# EAGLE design mini48-v0.3 (EAGLE 5.11)
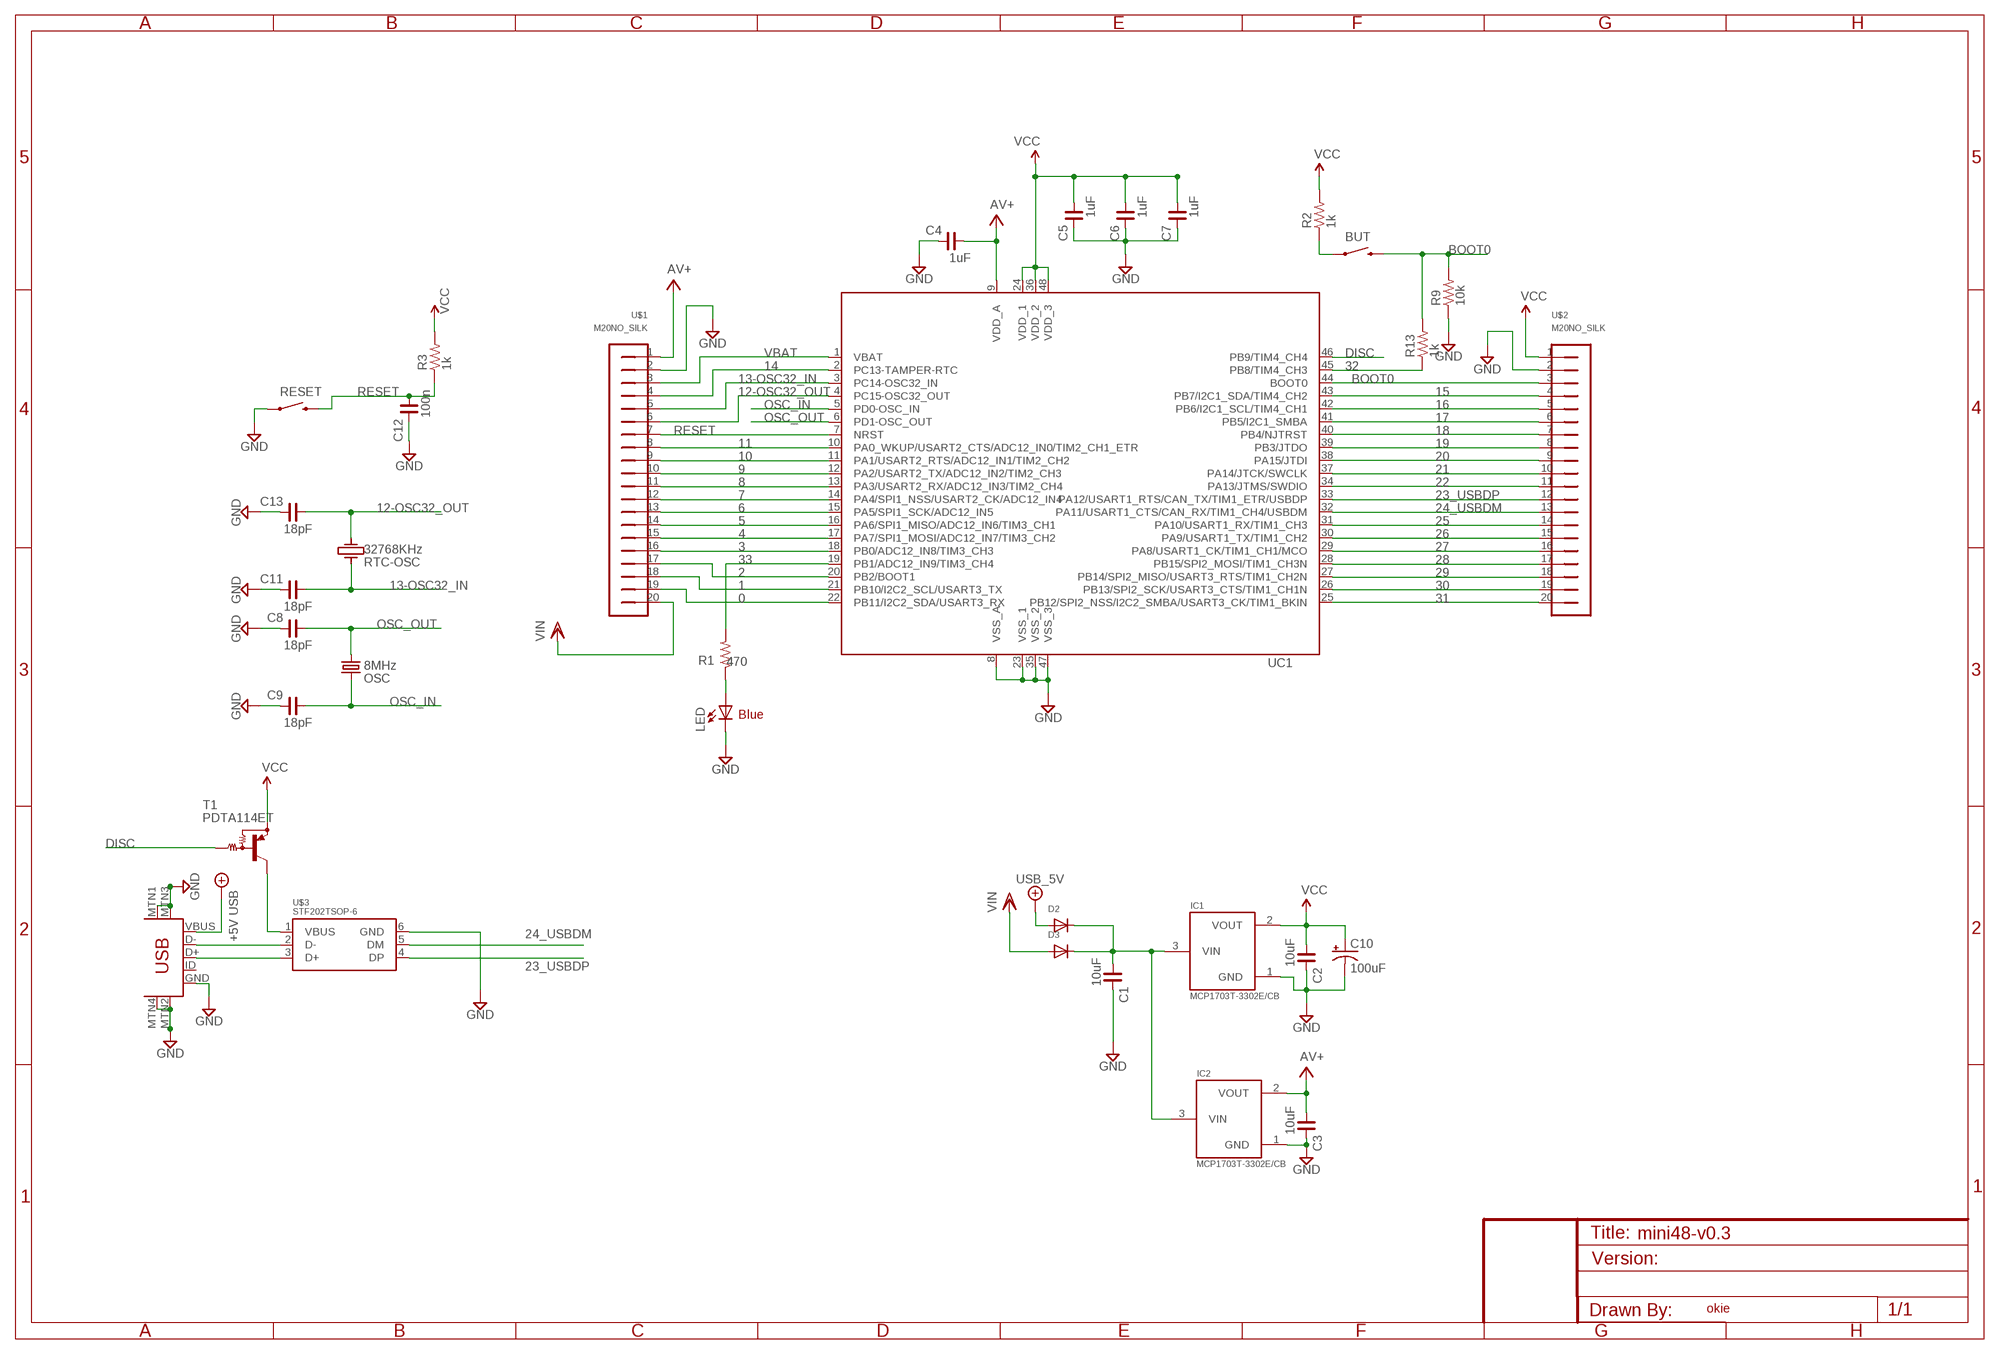
[diagram p0: schematic, sheet 1]

## Parts
BUT  SWITCH-MOMENTARY-2-SMD-1101NE  [TACTILE-SWITCH-1101NE]
C1  10uF  C_0805  [C0805]
C2  10uF  C_0805  [C0805]
C3  10uF  C_0805  [C0805]
C4  1uF  C_0603  [C0603]
C5  1uF  C_0603  [C0603]
C6  1uF  C_0603  [C0603]
C7  1uF  C_0603  [C0603]
C8  18pF  C_0603  [C0603]
C9  18pF  C_0603  [C0603]
C10  100uF  CAP_POL3528  [EIA3528]
C11  18pF  C_0603  [C0603]
C12  100n  C_0603  [C0603]
C13  18pF  C_0603  [C0603]
D2  DIODESOD-323  [SOD-323]
D3  DIODESOD-323  [SOD-323]
IC1  MCP1703T-3302E/CB  MCP1700T  [SOT23]
IC2  MCP1703T-3302E/CB  MCP1700T  [SOT23]
LED  LED (Mini)  LEDCHIPLED_0603  [CHIPLED_0603]
OSC  8MHz  CRYSTAL5X3  [CRYSTAL-SMD-5X3]
R1  470  R_0603  [R0603]
R2  1k  R_0603  [R0603]
R3  1k  R_0603  [R0603]
R9  10k  R_0603  [R0603]
R13  1k  R_0603  [R0603]
RESET  SWITCH-MOMENTARY-2-SMD-1101NE  [TACTILE-SWITCH-1101NE]
RTC-OSC  32768KHz  CRYSTALL  [KX-327LT]
T1  PDTA114ET  PNP-DRIVERSOT323  [SOT323R]
U$1  M20NO_SILK  [1X20_NO_SILK]
U$2  M20NO_SILK  [1X20_NO_SILK]
U$3  STF202TSOP-6  [TSOP-6]
UC1  STM32F103CB  [LQFP48]
USB  USB-MINIB-5PIN  [USB-MINIB]

## Nets
0: U$1.19 UC1.22(PB11/I2C2_SDA/USART3_RX)
1: U$1.18 UC1.21(PB10/I2C2_SCL/USART3_TX)
2: U$1.17 UC1.20(PB2/BOOT1)
3: U$1.16 UC1.18(PB0/ADC12_IN8/TIM3_CH3)
4: U$1.15 UC1.17(PA7/SPI1_MOSI/ADC12_IN7/TIM3_CH2)
5: U$1.14 UC1.16(PA6/SPI1_MISO/ADC12_IN6/TIM3_CH1)
6: U$1.13 UC1.15(PA5/SPI1_SCK/ADC12_IN5)
7: U$1.12 UC1.14(PA4/SPI1_NSS/USART2_CK/ADC12_IN4)
8: U$1.11 UC1.13(PA3/USART2_RX/ADC12_IN3/TIM2_CH4)
9: U$1.10 UC1.12(PA2/USART2_TX/ADC12_IN2/TIM2_CH3)
10: U$1.9 UC1.11(PA1/USART2_RTS/ADC12_IN1/TIM2_CH2)
11: U$1.8 UC1.10(PA0_WKUP/USART2_CTS/ADC12_IN0/TIM2_CH1_ETR)
12-OSC32_OUT: C13.1 RTC-OSC.1 U$1.6 UC1.4(PC15-OSC32_OUT)
13-OSC32_IN: C11.1 RTC-OSC.4 U$1.5 UC1.3(PC14-OSC32_IN)
14: U$1.4 UC1.2(PC13-TAMPER-RTC)
15: U$2.4 UC1.43(PB7/I2C1_SDA/TIM4_CH2)
16: U$2.5 UC1.42(PB6/I2C1_SCL/TIM4_CH1)
17: U$2.6 UC1.41(PB5/I2C1_SMBA)
18: U$2.7 UC1.40(PB4/NJTRST)
19: U$2.8 UC1.39(PB3/JTDO)
20: U$2.9 UC1.38(PA15/JTDI)
21: U$2.10 UC1.37(PA14/JTCK/SWCLK)
22: U$2.11 UC1.34(PA13/JTMS/SWDIO)
23_USBDP: U$2.12 U$3.4(DP) UC1.33(PA12/USART1_RTS/CAN_TX/TIM1_ETR/USBDP)
24_USBDM: U$2.13 U$3.5(DM) UC1.32(PA11/USART1_CTS/CAN_RX/TIM1_CH4/USBDM)
25: U$2.14 UC1.31(PA10/USART1_RX/TIM1_CH3)
26: U$2.15 UC1.30(PA9/USART1_TX/TIM1_CH2)
27: U$2.16 UC1.29(PA8/USART1_CK/TIM1_CH1/MCO)
28: U$2.17 UC1.28(PB15/SPI2_MOSI/TIM1_CH3N)
29: U$2.18 UC1.27(PB14/SPI2_MISO/USART3_RTS/TIM1_CH2N)
30: U$2.19 UC1.26(PB13/SPI2_SCK/USART3_CTS/TIM1_CH1N)
31: U$2.20 UC1.25(PB12/SPI2_NSS/I2C2_SMBA/USART3_CK/TIM1_BKIN)
32: R13.1 UC1.45(PB8/TIM4_CH3)
33: R1.2 UC1.19(PB1/ADC12_IN9/TIM3_CH4)
+5V/2 [vcc]: D2.A USB.VBUS ; supply symbol labelled USB_5V, +5V USB
AV+ [vcc]: C3.1 C4.1 IC2.2(VOUT) U$1.1 UC1.9(VDD_A)
BOOT0: BUT.P$2 R9.2 R13.2 U$2.3 UC1.44(BOOT0)
DGND: C1.2 C2.2 C3.2 C4.2 C5.2 C6.2 C7.2 C8.2 C9.2 C10.C(-) C11.2 C12.2 C13.2 IC1.1(GND) IC2.1(GND) LED.C R9.1 RESET.P$1 U$1.2 U$2.2 U$3.6(GND) UC1.8(VSS_A) UC1.23(VSS_1) UC1.35(VSS_2) UC1.47(VSS_3) USB.GND USB.MTN1(MTN2) USB.MTN2(MTN3) USB.MTN3(MTN1) USB.MTN4 ; supply symbol labelled GND
DISC: T1.1(B) UC1.46(PB9/TIM4_CH4)
N$1: BUT.P$1 R2.1
N$2: LED.A R1.1
N$5 [vcc]: C1.1 D2.C D3.C IC1.3(VIN) IC2.3(VIN)
N$6: T1.3(C) U$3.1(VBUS)
N$14: U$3.2(D-) USB.D-
N$17: U$3.3(D+) USB.D+
OSC_IN: C9.1 OSC.3 UC1.5(PD0-OSC_IN)
OSC_OUT: C8.1 OSC.1 UC1.6(PD1-OSC_OUT)
RESET: C12.1 R3.1 RESET.P$2 U$1.7 UC1.7(NRST)
VBAT: U$1.3 UC1.1(VBAT)
VCC [vcc]: C2.1 C5.1 C6.1 C7.1 C10.A(+) IC1.2(VOUT) R2.2 R3.2 T1.2(E) U$2.1 UC1.24(VDD_1) UC1.36(VDD_2) UC1.48(VDD_3)
VIN: D3.A U$1.20
Unconnected: USB.ID

## Notes on the sheet
- BOOT0
- Blue
- okie

## Library data of the parts
BUT RESET = SparkFun:SWITCH-MOMENTARY-2
C1-C9 C11-C13 = rc-master-smd:C_: NON-POLARIZED CAP
C10 = es:CAP_POL: Capacitor Polarized These are standard SMD and PTH capacitors. Normally 10uF, 47uF, and 100uF in electrolytic and tantalum varieties. Always verify the external diameter of the through hole cap, it varies with capacity, voltage, and manufacturer. The EIA devices should be standard.
D2 D3 = es:DIODE: Diode SMADIODE - SMA Surface Mount Package 20V 1A Schottky Diode Digikey: 641-1014-6-ND DO-1N4148 - Through Hole Small Current Diode SOD-123 20V 1 A (.5mV Vf) Schottky Diode - Digikey: MBRX120TPMSCT-ND SOD-323 10V 570mA (.38mV Vf, 3ns) Schottky Diode - Digikey: ZLLS410CT-ND SOD-523 30V 30mA Schottky Diode (RB751S-40TE61) - Digikey: RB751S-40TE61CT-ND SOT23-R/W - SOT23 Package (R = Solder Paste/Reflow Ovens, W = Hand-Soldering) BAT54Film 40V 300mA - Digikey: 497-7162-1-ND
IC1 IC2 = okie:MCP1700T
LED = led:LED: LED OSRAM: - CHIPLED LG R971, LG N971, LY N971, LG Q971, LY Q971, LO R971, LY R971 LH N974, LH R974 LS Q976, LO Q976, LY Q976 LO Q996 - Hyper CHIPLED LW Q18S LB Q993, LB Q99A, LB R99A - SideLED LS A670, LO A670, LY A670, LG A670, LP A670 LB A673, LV A673, LT A673, LW A673 LH A674 LY A675 LS A676, LA A676, LO A676, LY A676, LW A676 LS A679, LY A679, LG A679 - Hyper Micro SIDELED® LS Y876, LA Y876, LO Y876, LY Y876 LT Y87S - SmartLED LW L88C, LW L88S LB L89C, LB L89S, LG L890 LS L89K, LO L89K, LY L89K LS L896, LA L896, LO L896, LY L896 - TOPLED LS T670, LO T670, LY T670, LG T670, LP T670 LSG T670, LSP T670, LSY T670, LOP T670, LYG T670 LG T671, LOG T671, LSG T671 LB T673, LV T673, LT T673, LW T673 LH T674 LS T676, LA T676, LO T676, LY T676, LB T676, LH T676, LSB T676, LW T676 LB T67C, LV T67C, LT T67C, LS T67K, LO T67K, LY T67K, LW E67C LS E67B, LA E67B, LO E67B, LY E67B, LB E67C, LV E67C, LT E67C LW T67C LS T679, LY T679, LG T679 LS T770, LO T770, LY T770, LG T770, LP T770 LB T773, LV T773, LT T773, LW T773 LH T774 LS E675, LA E675, LY E675, LS T675 LS T776, LA T776, LO T776, LY T776, LB T776 LHGB T686 LT T68C, LB T68C - Hyper Mini TOPLED® LB M676 - Mini TOPLED Santana® LG M470 LS M47K, LO M47K, LY M47K Source: http://www.osram.convergy.de LUXEON: - LUMILED® LXK2-PW12-R00, LXK2-PW12-S00, LXK2-PW14-U00, LXK2-PW14-V00 LXK2-PM12-R00, LXK2-PM12-S00, LXK2-PM14-U00 LXK2-PE12-Q00, LXK2-PE12-R00, LXK2-PE12-S00, LXK2-PE14-T00, LXK2-PE14-U00 LXK2-PB12-K00, LXK2-PB12-L00, LXK2-PB12-M00, LXK2-PB14-N00, LXK2-PB14-P00, LXK2-PB14-Q00 LXK2-PR12-L00, LXK2-PR12-M00, LXK2-PR14-Q00, LXK2-PR14-R00 LXK2-PD12-Q00, LXK2-PD12-R00, LXK2-PD12-S00 LXK2-PH12-R00, LXK2-PH12-S00 LXK2-PL12-P00, LXK2-PL12-Q00, LXK2-PL12-R00 Source: www.luxeon.com KINGBRIGHT: KA-3528ASYC Source: www.kingbright.com
OSC = SparkFun_20110922_my:CRYSTAL: Crystals Various standard crystals. Proven footprints. Spark Fun Electronics SKU : COM-00534
R1-R3 R9 R13 = rc-master-smd:R_: RESISTOR
RTC-OSC = es:CRYSTALL
T1 = es:PNP-DRIVER
U$1 U$2 = es:M20
U$3 = es:STF202
UC1 = stm32:STM32F103CB
USB = SparkFun_20110922_my:USB-MINIB: Mini-USB "B" connector with 5th pin broken out. Created new symbol breaking out 5th "ID" pin in mini/micro USB connector spec. See: http://en.wikipedia.org/wiki/Mini_usb#Cables. Uses same footprint as 4-pin symbol. Also added pins to connect to mounting / shield pads if required (probably not generally needed as signals aren't shielded once they leave the connector).

## Net classes
1 vcc: width 0.2 mm

## Board
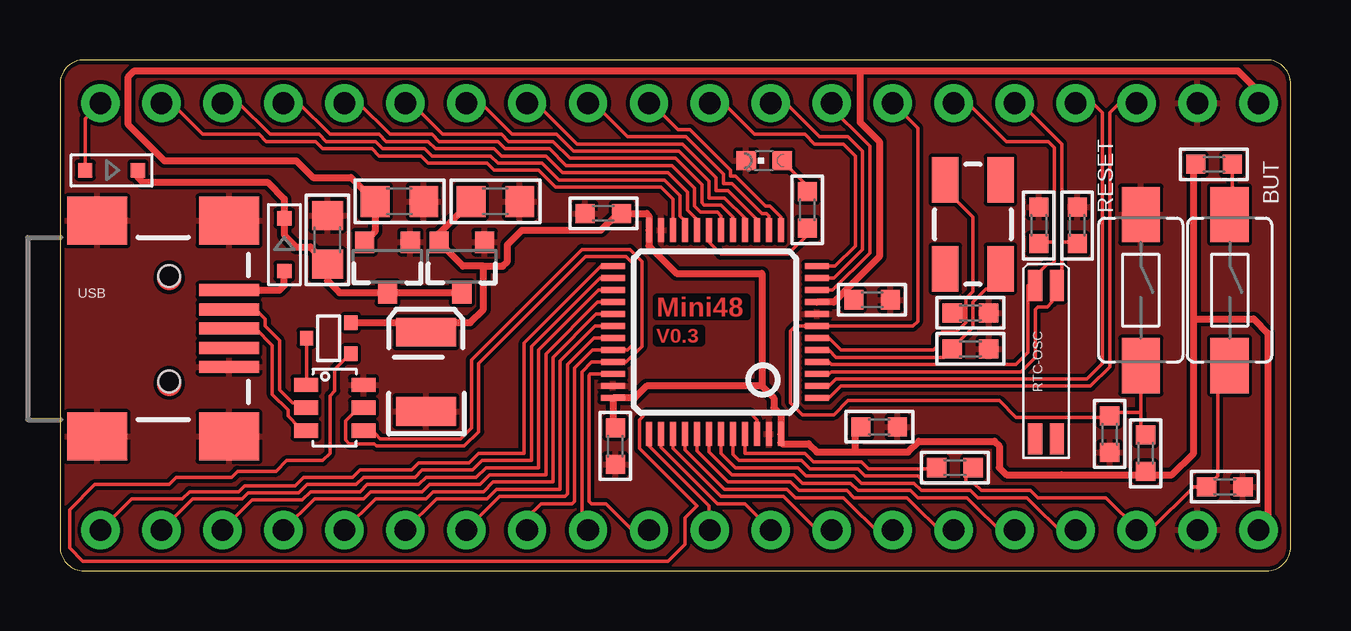
[diagram p1: board, top side]

Size 51.3 x 21.3 mm. Coordinates in mm from the lower left corner, seen from the top.
Outline: 0,1 arc90 1,0 50.3,0 arc90 51.3,1 51.3,20.3 arc90 50.3,21.3 1,21.3 arc90 0,20.3 0,1
Copper layers (1*16): Top 0.018mm / dielectric 1.5mm / Bottom 0.018mm
Design rules "es-015mm *": minimum track width 0.15mm, minimum drill 0.4mm, track to track 0.15mm, track to pad 0.15mm, pad to pad 0.15mm, via to via 0.15mm, smd to smd 0.15mm, copper to edge 0.18mm, drill to drill 0.15mm, minimum pad ring 0.35mm, minimum via ring 0.35mm, stop-mask expansion 0mil, vias tented up to drill 25mil, thermal gap 0.15mm
tRestrict: 3 lines

### Footprints (pad centres in the part's own frame; a part is rotated, then mirrored left to right if it is on the bottom)
TACTILE-SWITCH-1101NE = smd 2.3 x 1.6: P$1 -3.15,0; P$2 3.15,0
C0805 = smd 1.2 x 1.3: 1 -1.016,0; 2 1.016,0
C0603 = smd 0.8 x 0.8: 1 -0.762,0; 2 0.762,0
EIA3528 = smd 1.2 x 2.5: A 1.65,0; C -1.65,0
SOD-323 = smd 0.6 x 0.6: A 1.1,0; C -1.1,0
SOT23 = smd 0.8 x 0.9: 1 -0.95,-1; 2 0.95,-1; 3 0,1.1
CHIPLED_0603 = smd 0.8 x 0.8: A 0,-0.75; C 0,0.75
CRYSTAL-SMD-5X3 = smd 1.9 x 1.1: 1 -1.85,-1.15; 2 1.85,-1.15; 3 1.85,1.15; 4 -1.85,1.15
R0603 = smd 0.8 x 0.8: 1 -0.762,0; 2 0.762,0
KX-327LT = smd 1.3 x 0.6: 1 -3.2,-0.5; 2 3.2,-0.5; 3 3.2,0.4; 4 -3.2,0.4
SOT323R = smd 0.6 x 0.55: 1 -0.65,-0.925; 2 0.65,-0.925; 3 0,0.925
1X20_NO_SILK = drill 0.9 round: 1 0,0; 2 2.54,0; 3 5.08,0; 4 7.62,0; 5 10.16,0; 6 12.7,0; 7 15.24,0; 8 17.78,0; 9 20.32,0; 10 22.86,0; 11 25.4,0; 12 27.94,0; 13 30.48,0; 14 33.02,0; 15 35.56,0; 16 38.1,0; 17 40.64,0; 18 43.18,0; 19 45.72,0; 20 48.26,0
TSOP-6 = smd 0.6 x 1: 1 -0.95,-1.2; 2 0,-1.2; 3 0.95,-1.2; 4 0.95,1.2; 5 0,1.2; 6 -0.95,1.2
LQFP48 = smd 0.254 x 1: 1 -2.75,-4.25; 2 -2.25,-4.25; 3 -1.75,-4.25; 4 -1.25,-4.25; 5 -0.75,-4.25; 6 -0.25,-4.25; 7 0.25,-4.25; 8 0.75,-4.25; 9 1.25,-4.25; 10 1.75,-4.25; 11 2.25,-4.25; 12 2.75,-4.25; 25 2.75,4.25; 26 2.25,4.25; 27 1.75,4.25; 28 1.25,4.25; 29 0.75,4.25; 30 0.25,4.25; 31 -0.25,4.25; 32 -0.75,4.25; 33 -1.25,4.25; 34 -1.75,4.25; 35 -2.25,4.25; 36 -2.75,4.25 | smd 1 x 0.254: 13 4.25,-2.75; 14 4.25,-2.25; 15 4.25,-1.75; 16 4.25,-1.25; 17 4.25,-0.75; 18 4.25,-0.25; 19 4.25,0.25; 20 4.25,0.75; 21 4.25,1.25; 22 4.25,1.75; 23 4.25,2.25; 24 4.25,2.75; 37 -4.25,2.75; 38 -4.25,2.25; 39 -4.25,1.75; 40 -4.25,1.25; 41 -4.25,0.75; 42 -4.25,0.25; 43 -4.25,-0.25; 44 -4.25,-0.75; 45 -4.25,-1.25; 46 -4.25,-1.75; 47 -4.25,-2.25; 48 -4.25,-2.75
USB-MINIB = smd 2.5 x 0.5: D+ 2.5,0; D- 2.5,0.8; GND 2.5,-1.6; ID 2.5,-0.8; VBUS 2.5,1.6 | smd 2.5 x 2: MTN1 -3,4.5; MTN2 2.5,4.5; MTN3 -3,-4.5; MTN4 2.5,-4.5 | hole 0.9: 0,2.2; 0,-2.2

### Placement (x,y rotation side)
BUT  48.75,11.7 270 top
C1  11.15,13.8 90 top
C2  18.15,15.4 0 top
C3  14.15,15.4 0 top
C4  33.85,11.3 0 top
C5  23.15,5.2 270 top
C6  22.65,14.9 180 top
C7  34.15,6 0 top
C8  37.95,10.75 0 top
C9  37.95,9.25 0 top
C10  15.25,8.3 90 top
C11  42.4,14.4 90 top
C12  43.75,5.7 270 top
C13  40.8,14.4 90 top
D2  9.35,13.6 270 top
D3  2.15,16.7 180 top
IC1  16.75,12.7 180 top
IC2  13.65,12.7 180 top
LED  29.35,17.1 90 top
OSC  38.05,14.45 270 top
R1  31.15,15.05 270 top
R2  48.1,16.95 180 top
R3  45.25,4.9 270 top
R9  48.55,3.5 180 top
R13  37.3,4.3 0 top
RESET  45.05,11.7 270 top
RTC-OSC  41.15,8.7 270 top
T1  11.2,9.7 90 top
U$1  49.95,19.5 180 top
U$2  49.95,1.7 180 top
U$3  11.45,6.8 270 top
UC1  27.3,9.95 90 top
USB  4.55,10.1 0 top

### Tracks (layer width: path | path; a pad name or v marks a point on that pad's centre or on a via)
0
  Top 0.15: U$1.19 4.65,19.5 5.95,18.2 8.3,18.2 8.6,17.9 10.65,17.9 10.95,17.6 13,17.6 13.3,17.3 15.05,17.3 15.35,17 17.8,17 18.1,16.7 19.95,16.7 20.65,16 25.05,16 25.55,15.5 UC1.22
1
  Top 0.15: U$1.18 7.45,19.5 8.75,18.2 10.8,18.2 11.1,17.9 13.15,17.9 13.45,17.6 15.2,17.6 15.5,17.3 17.95,17.3 18.25,17 20.1,17 20.8,16.3 25.2,16.3 25.85,15.65 25.85,14.8 26.05,14.6 UC1.21
2
  Top 0.15: U$1.17 9.95,19.5 11.25,18.2 13.3,18.2 13.6,17.9 15.35,17.9 15.65,17.6 18.1,17.6 18.4,17.3 20.25,17.3 20.95,16.6 25.35,16.6 26.15,15.8 26.15,15.05 26.55,14.65 UC1.20
3
  Top 0.15: U$1.16 12.45,19.5 13.75,18.2 15.5,18.2 15.8,17.9 18.25,17.9 18.55,17.6 20.4,17.6 21.1,16.9 25.5,16.9 26.45,15.95 26.45,15.2 26.7,14.95 27.4,14.95 27.55,14.8 UC1.18
4
  Top 0.15: U$1.15 14.65,19.5 15.95,18.2 18.4,18.2 18.7,17.9 20.55,17.9 21.25,17.2 25.65,17.2 26.75,16.1 26.75,15.35 26.85,15.25 27.55,15.25 28.05,14.75 UC1.17
5
  Top 0.15: U$1.14 17.55,19.5 18.85,18.2 20.7,18.2 21.4,17.5 25.8,17.5 27.05,16.25 27.05,15.55 27.7,15.55 28.55,14.7 UC1.16
6
  Top 0.15: U$1.13 19.85,19.5 21.55,17.8 25.95,17.8 27.35,16.4 27.35,15.85 27.85,15.85 29.05,14.65 UC1.15
7
  Top 0.15: U$1.12 22.25,19.5 23.65,18.1 26.1,18.1 27.65,16.55 27.65,16.15 28,16.15 29.25,14.9 29.45,14.9 29.55,14.8 UC1.14
8
  Top 0.15: U$1.11 24.65,19.5 25.75,18.4 26.25,18.4 27.95,16.7 27.95,16.45 28.15,16.45 29.4,15.2 29.6,15.2 30.05,14.75 UC1.13 30.05,14.6
9
  Top 0.15: UC1.12 32.3,12.7 33.15,13.55 33.15,17.3 32.65,17.8 31.45,17.8 31.05,18.2 28.95,18.2 27.65,19.5 U$1.10
10
  Top 0.15: UC1.11 32.25,12.2 33.45,13.4 33.45,17.5 32.85,18.1 31.65,18.1 30.25,19.5 U$1.9
11
  Top 0.15: UC1.10 32.2,11.7 33.75,13.25 33.75,17.7 31.95,19.5 U$1.8
12-OSC32_OUT
  Top 0.15: UC1.4 32.05,8.7 32.15,8.6 39.85,8.6 40.35,9.1 40.35,11.9 RTC-OSC.1 40.75,12 40.75,12.4 41.15,12.8 41.35,12.8 41.45,12.9 41.45,13.7 | U$1.6 37.85,19.5 39.45,17.9 41.2,17.9 41.45,17.65 41.45,13.7 | C13.1 40.8,13.7 41.45,13.7
13-OSC32_IN
  Top 0.15: UC1.3 32.05,8.2 32.15,8.3 40.05,8.3 40.65,8.9 40.65,10.9 40.75,11 41.15,11 41.35,11.2 41.35,11.7 RTC-OSC.4 | 41.75,13.7 41.75,17.8 40.05,19.5 U$1.5 | RTC-OSC.4 41.55,12.2 | 41.75,13.7 42.34,13.7 C11.1 | 41.75,13.7 41.75,12.1 RTC-OSC.4
14
  Top 0.15: UC1.2 32.05,7.7 32.35,8 42.8,8 43.45,8.65 43.45,19.1 43.05,19.5 U$1.4
15
  Top 0.15: UC1.43 27.55,4.9 28.15,4.3 30.75,4.3 31.1,3.95 33.1,3.95 33.4,3.65 35.6,3.65 35.9,3.35 37.95,3.35 38.25,3.05 40.3,3.05 40.6,2.75 41.65,1.7 U$2.4
16
  Top 0.15: UC1.42 27.05,4.95 28,4 30.6,4 30.95,3.65 32.95,3.65 33.25,3.35 35.45,3.35 35.75,3.05 37.8,3.05 38.1,2.75 39.15,1.7 U$2.5
17
  Top 0.15: UC1.41 26.55,5 27.85,3.7 30.45,3.7 30.8,3.35 32.8,3.35 33.1,3.05 35.3,3.05 35.6,2.75 36.65,1.7 U$2.6
18
  Top 0.15: UC1.40 26.05,5.05 27.7,3.4 30.3,3.4 30.65,3.05 32.65,3.05 32.95,2.75 34,1.7 U$2.7
19
  Top 0.15: U$2.8 31.55,1.7 30.5,2.75 30.15,3.1 27.55,3.1 25.55,5.1 UC1.39
20
  Top 0.15: U$2.9 29.65,1.7 28.55,2.8 27.4,2.8 25.05,5.15 UC1.38
21
  Top 0.15: UC1.37 24.55,5.2 27.05,2.7 27.05,1.74 U$2.10
22
  Top 0.15: U$2.11 23.85,1.7 22.75,2.8 22.15,2.8 22.05,2.9 22.05,8.15 22.1,8.2 UC1.34
23_USBDP
  Top 0.15: U$2.12 22.05,1.74 22.05,1.9 21.75,2.2 21.75,8.3 22.15,8.7 UC1.33 23.6,8.7 24.25,9.35 24.25,12.9 23.75,13.4 21.75,13.4 19.15,10.8 17.15,8.8 17.15,5.95 16.7,5.5 13.35,5.5 13.15,5.7 13,5.85 U$3.4
24_USBDM
  Top 0.15: U$2.13 19.45,1.72 19.45,2.2 20.05,2.8 21.35,2.8 21.45,2.9 21.45,8.45 22.2,9.2 UC1.32 23.65,9.2 23.95,9.5 23.95,12.75 23.6,13.1 21.9,13.1 19.3,10.5 17.45,8.65 17.45,5.8 16.85,5.2 13.2,5.2 13.1,5.3 12.05,5.3 11.9,5.45 11.9,6.25 12.45,6.8 U$3.5
25
  Top 0.15: U$2.14 18.33,3.1 21.05,3.1 21.15,3.2 21.15,8.6 22.25,9.7 UC1.31
26
  Top 0.15: U$2.15 15.69,3 17.8,3 18.2,3.4 20.85,3.4 20.85,8.75 22.3,10.2 UC1.30
27
  Top 0.15: U$2.16 13.15,3 15.25,3 15.55,3.3 17.65,3.3 18.05,3.7 20.55,3.7 20.55,8.9 22.35,10.7 UC1.29
28
  Top 0.15: U$2.17 10.61,3 12.65,3 12.95,3.3 15.1,3.3 15.4,3.6 17.5,3.6 17.9,4 20.25,4 20.25,9.05 22.4,11.2 UC1.28
29
  Top 0.15: U$2.18 8.02,2.95 10.1,2.95 10.45,3.3 12.5,3.3 12.8,3.6 14.95,3.6 15.25,3.9 17.35,3.9 17.75,4.3 19.95,4.3 19.95,9.2 22.45,11.7 UC1.27
30
  Top 0.15: U$2.19 5.53,3 7.6,3 7.85,3.25 9.95,3.25 10.3,3.6 12.35,3.6 12.65,3.9 14.8,3.9 15.1,4.2 17.2,4.2 17.6,4.6 19.65,4.6 19.65,9.35 22.5,12.2 UC1.26
31
  Top 0.15: U$2.20 2.99,3 5.1,3 5.4,3.3 7.45,3.3 7.7,3.55 9.8,3.55 10.15,3.9 12.2,3.9 12.5,4.2 14.65,4.2 14.95,4.5 17.05,4.5 17.45,4.9 19.35,4.9 19.35,9.5 22.55,12.7 UC1.25
32
  Top 0.15: UC1.45 28.55,4.9 28.85,4.9 31.05,4.9 31.4,4.55 33.4,4.55 33.7,4.25 36.3,4.25 36.35,4.3 R13.1
33
  Top 0.15: R1.2 31.15,14 30.35,13.2 27.55,13.2 27.05,13.7 UC1.19
+5V/2
  Top 0.3: USB.VBUS 9.15,11.7 9.35,11.9 D2.A
AV+
  Top 0.3: 33.35,20.85 3.1,20.85 2.85,20.6 2.85,18.6 4.35,17.1 9.85,17.1 10.55,16.4 12.13,16.4 C3.1 13.13,14.13 IC2.2 | 33.35,20.85 49.1,20.85 49.95,20 U$1.1 | UC1.9 32.25,11.2 32.7,11.65 | 32.7,11.65 34.15,13.1 34.15,17.9 33.35,18.7 33.35,20.85 | C4.1 33.05,11.3 32.7,11.65
BOOT0
  Top 0.15: 37.75,3.65 36.05,3.65 35.75,3.95 33.55,3.95 33.25,4.25 31.25,4.25 30.9,4.6 28.3,4.6 28.05,4.85 UC1.44 | 37.75,3.65 38.1,3.65 38.4,3.35 40.45,3.35 40.75,3.05 43.6,3.05 44.95,1.7 U$2.3 45.45,1.7 47.25,3.5 R9.2 48.25,3.96 48.25,7.7 48.25,8.05 BUT.P$2 | R13.2 37.75,4.3 37.75,3.65
DGND
  pour Top: -0.75,22.5 -0.75,-2.2 51.65,-2.2 51.65,22.5
DISC
  Top 0.15: T1.1 12.1,9.05 11.45,8.4 11.45,7.5 11.25,7.3 11.25,4.9 10.95,4.6 9.45,4.6 9,4.15 7.4,4.15 7.15,3.9 4.85,3.9 4.55,3.6 1.45,3.6 0.4,2.55 0.4,0.95 0.95,0.4 25.35,0.4 26.05,1.1 26.05,2.2 26.55,2.7 24.15,5.1 24.15,6.3 24.45,6.6 28.75,6.6 29.05,6.3 UC1.46
N$1
  Top 0.15: R2.1 48.86,14.96 BUT.P$1
N$2
  Top 0.15: R1.1 31.15,16.05 LED.A
N$5
  Top 0.3: D3.C 3.25,16.4 3.45,16.2 8.65,16.2 9.35,15.5 D2.C 9.35,14 9.85,13.5 10.43,13.5 C1.1 11.15,12.1 11.65,11.6 IC2.3 IC1.3
N$6
  Top 0.15: T1.3 10.28,7.78 U$3.1
N$14
  Top 0.15: USB.D- 8.15,10.9 8.55,10.5 8.55,10.2 9.15,9.6 9.15,7.55 9.7,7 10.05,7 U$3.2
N$17
  Top 0.15: USB.D+ 8.15,10.1 8.85,9.4 8.85,7.35 9.5,6.7 9.5,6.45 9.95,6 10.1,6 U$3.3
OSC_IN
  Top 0.15: UC1.5 32.05,9.2 32.35,8.9 36.84,8.9 C9.1 37.19,9.29 38.05,10.15 38.05,11.2 38.6,11.75 38.85,11.75 39.05,11.95 39.05,12.45 OSC.3
OSC_OUT
  Top 0.15: UC1.6 32.05,9.7 32.55,9.2 36.4,9.2 36.55,9.35 36.55,9.75 36.75,9.95 37.35,9.95 37.75,10.35 37.75,10.45 | 37.75,10.45 37.75,10.55 | 37.75,10.55 37.75,10.65 | 37.75,10.65 37.75,10.75 | 37.75,10.75 37.75,10.85 | 37.75,10.85 37.75,10.95 | 37.75,10.95 37.75,11.05 | 37.75,11.05 37.75,11.35 38.05,11.65 38.05,14.75 37.35,15.45 37.35,15.85 OSC.1 | 37.75,10.75 C8.1 | 37.75,10.65 37.19,10.65 | 37.75,10.55 37.19,10.55 | 37.75,10.45 37.19,10.45 | 37.75,11.05 37.19,11.05 | 37.75,10.95 37.19,10.95 | 37.75,10.85 37.19,10.85
RESET
  Top 0.15: U$1.7 35.75,18.46 35.75,10.4 35.55,10.2 UC1.7 30.65,10.2 30.45,10 30.45,7 30.95,6.5 32.25,6.5 32.85,7.1 39.15,7.1 39.85,6.4 43.71,6.4 43.71,6.42 C12.1 43.89,6.6 45.05,6.6 | 45.05,6.6 RESET.P$2 | 45.05,6.6 45.05,5.86 R3.1
VBAT
  Top 0.15: UC1.1 32.05,7.2 32.55,7.7 42.95,7.7 43.75,8.5 43.75,19.1 44.15,19.5 U$1.3
VCC
  Top 0.3: 47.25,10.5 47.25,4.9 46.35,4 45.25,4 | 47.25,10.5 49.75,10.5 50.35,9.9 50.35,2.1 U$2.1 | 33.15,4.95 31.55,4.95 31.2,5.3 30.1,5.3 30.05,5.35 UC1.48 30.05,6.5 29.75,6.8 29.75,7.2 29.25,7.7 | 33.15,4.95 35.35,4.95 35.8,5.4 38.95,5.4 39.15,5.2 39.15,4.3 39.45,4 41.75,4 45.25,4 | 17.65,12.7 18.45,12.7 18.65,12.9 18.65,13.6 19.25,14.2 22.55,14.2 23.25,14.9 C6.1 24.45,14.9 24.55,14.8 UC1.24 24.55,13.55 25.7,12.4 29.25,12.4 29.25,7.7 | 17.65,12.7 16.8,12.7 IC1.2 15.8,14.07 C2.1 | C5.1 23.05,6.06 UC1.36 23.95,7.2 24.45,7.7 29.25,7.7 | T1.2 15.25,10.35 | 15.25,10.35 17.1,10.35 17.65,10.9 17.65,12.7 | C7.1 33.35,6 33.15,5.8 33.15,4.95 | 15.25,10.35 C10.A | 45.25,4 R3.2 | R2.2 47.3,16.95 47.25,16.9 47.25,10.5
VIN
  Top 0.15: D3.A 1.05,18.86 U$1.20
(copper drawn outside any net)
  shapes: Top circle x2

### Text on the board
Top: Mini48 | V0.3